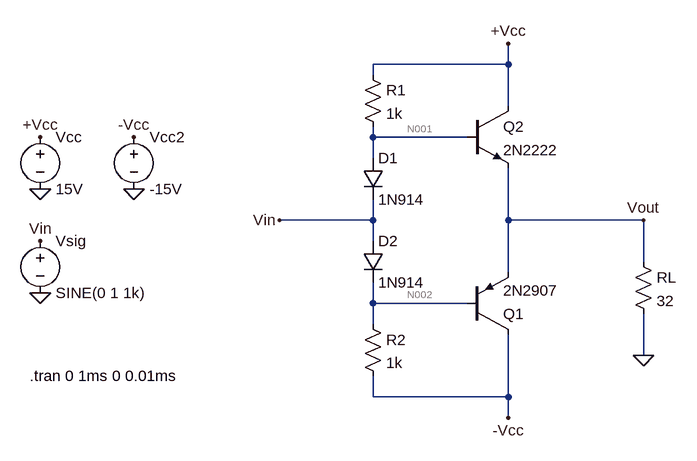
[diagram p0: schematic PushPull.asc]
PushPull.asc, the LTspice schematic file:
Version 4
SHEET 1 1208 680
WIRE 288 -160 288 -192
WIRE 288 -160 80 -160
WIRE 80 -144 80 -160
WIRE 288 -96 288 -160
WIRE 80 -48 80 -64
WIRE 224 -48 80 -48
WIRE 80 -16 80 -48
WIRE 80 80 80 48
WIRE 80 80 -64 80
WIRE 288 80 288 0
WIRE 496 80 288 80
WIRE 80 112 80 80
WIRE 496 144 496 80
WIRE 288 160 288 80
WIRE 80 208 80 176
WIRE 224 208 80 208
WIRE 80 240 80 208
WIRE 496 288 496 224
WIRE 80 352 80 320
WIRE 288 352 288 256
WIRE 288 352 80 352
WIRE 288 384 288 352
FLAG 496 288 0
FLAG -432 32 0
FLAG -288 32 0
FLAG -432 192 0
FLAG -432 -48 +Vcc
FLAG -288 -48 -Vcc
FLAG -432 112 Vin
FLAG 288 384 -Vcc
FLAG 288 -192 +Vcc
FLAG -64 80 Vin
FLAG 496 80 Vout
SYMBOL pnp 224 256 M180
SYMATTR InstName Q1
SYMATTR Value 2N2907
SYMBOL npn 224 -96 R0
SYMATTR InstName Q2
SYMATTR Value 2N2222
SYMBOL res 480 128 R0
SYMATTR InstName RL
SYMATTR Value 32
SYMBOL voltage -432 -64 R0
WINDOW 123 0 0 Left 0
WINDOW 39 0 0 Left 0
SYMATTR InstName Vcc
SYMATTR Value 15V
SYMBOL voltage -288 -64 R0
WINDOW 123 0 0 Left 0
WINDOW 39 0 0 Left 0
SYMATTR InstName Vcc2
SYMATTR Value -15V
SYMBOL voltage -432 96 R0
WINDOW 123 0 0 Left 0
WINDOW 39 0 0 Left 0
SYMATTR InstName Vsig
SYMATTR Value SINE(0 1 1k)
SYMBOL res 64 -160 R0
SYMATTR InstName R1
SYMATTR Value 1k
SYMBOL res 64 224 R0
SYMATTR InstName R2
SYMATTR Value 1k
SYMBOL diode 64 -16 R0
SYMATTR InstName D1
SYMATTR Value 1N914
SYMBOL diode 64 112 R0
SYMATTR InstName D2
SYMATTR Value 1N914
TEXT -448 320 Left 2 !.tran 0 1ms 0 0.01ms

The netlist it stands for:
* PushPull.asc
Q1 -Vcc N002 Vout 0 2N2907
Q2 +Vcc N001 Vout 0 2N2222
RL Vout 0 32
Vcc +Vcc 0 15V
Vcc2 -Vcc 0 -15V
Vsig Vin 0 SINE(0 1 1k)
R1 +Vcc N001 1k
R2 N002 -Vcc 1k
D1 N001 Vin 1N914
D2 Vin N002 1N914
.model D D
.lib standard.dio
.model NPN NPN
.model PNP PNP
.lib standard.bjt
.tran 0 1ms 0 0.01ms
.backanno
.end

* Results of the author's LTspice run, read from the files saved beside the schematic
* Operating Point, zero values left out:
*   V(-vcc) = -15 V
*   V(n002) = -712.7 mV
*   V(vout) = 227.1 µV
*   V(+vcc) = 15 V
*   V(n001) = 712.6 mV
*   Ic(Q2) = 9.329 mA
*   Ib(Q2) = 41.93 µA
*   Ie(Q2) = -9.371 mA
*   Ic(Q1) = -9.33 mA
*   Ib(Q1) = -34.28 µA
*   Ie(Q1) = 9.364 mA
*   I(D2) = 14.25 mA
*   I(D1) = 14.25 mA
*   I(R2) = 14.29 mA
*   I(R1) = 14.29 mA
*   I(Rl) = 7.097 µA
*   I(Vsig) = -7.622 µA
*   I(Vcc2) = 23.62 mA
*   I(Vcc) = -23.62 mA
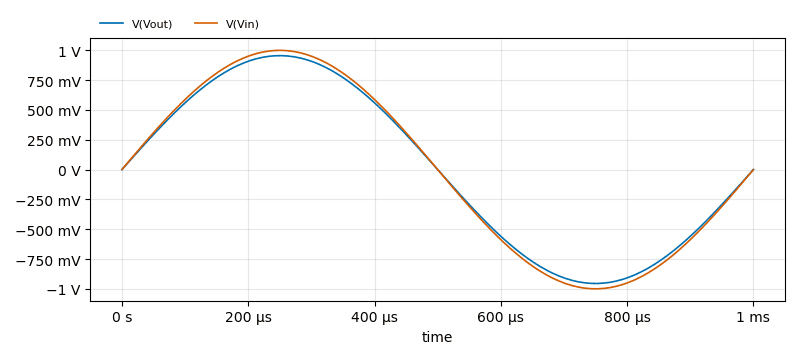
[diagram p1: Transient Analysis of PushPull.asc, plotted from the saved traces]
* Transient Analysis, 1 run:
*   V(Vout): min -955.2 mV, max 955.4 mV, average 160.8 µV, rms 674.8 mV, last 226.8 µV
*   V(Vin): min -999.8 mV, max 999.8 mV, average -2.409 µV, rms 707.1 mV, last 0 V